# Altium schematic sheet Somador_DC.SchDoc
size A4
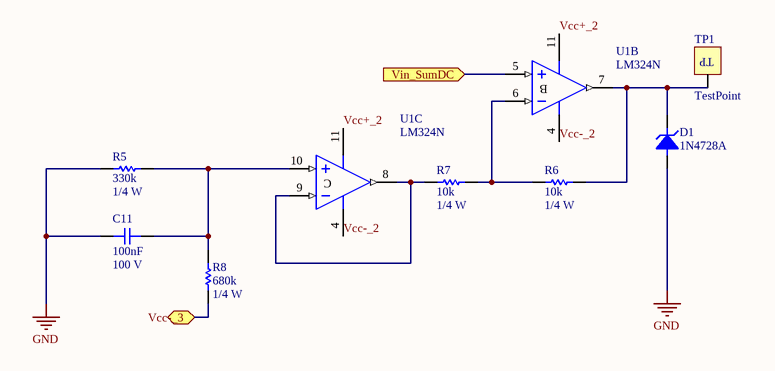
[diagram p0: Somador_DC.SchDoc]

## Parts
C11  100nF  Voltage: 100 V  [0805C]
D1  1N4728A  [DO-41-Glass]
R5  330k  Power: 1/4 W  [0805R]
R6  10k  Power: 1/4 W  [0805R]
R7  10k  Power: 1/4 W  [0805R]
R8  680k  Power: 1/4 W  [0805R]
TP1  TestPoint  [TEST_POINT_PTH]
U1  LM324N  [N014]  (parts B,C of 4)

## Ports
Vcc-_3, Vin_SumDC (in)

## Nets
GND: C11.2 D1.A R5.2
Vcc+_2: U1.11(V-)
Vcc-_2: U1.4(V+)
Vcc-_3: R8.1 ; port Vcc-_3
Vin_SumDC: U1.5(IN+) ; port Vin_SumDC
NetC11_1: C11.1 R5.1 R8.2 U1.10(IN+)
NetD1_K: D1.K R6.2 TP1.1(TP) U1.7(OUT)
NetR6_1: R6.1 R7.2 U1.6(IN-)
NetR7_1: R7.1 U1.8(OUT) U1.9(IN-)

## Notes on the sheet
- (in symbol LM324N, part B) B
- (in symbol LM324N, part C) C

## Library data of the parts
C11 = Capacitor: Published: 8-Jun-2000; LatestRevisionDate: 17-Jul-2002; LatestRevisionNote: Re-released for DXP Platform.; PackageReference: RAD-0.3; Publisher: Altium Limited
D1 = 1N4728A: Zener Diode; Zener Voltage (Vz): 3.3 V; Zener Current (Iz): 276 mA; Power Dissipation (Pd): 1.3 W; Forward Voltage (Vf): 1.2 V
R5-R8 = Resistor: Tolerance: 5%; Published: 8-Jun-2000; LatestRevisionDate: 17-Jul-2002; LatestRevisionNote: Re-released for DXP Platform.; PackageReference: AXIAL-0.3; Publisher: Altium Limited
TP1 = TestPoint: Test Point
U1 = LM324N: Quadruple Operational Amplifier; Published: 16-Jan-2001; LatestRevisionDate: 04-Mar-2005; LatestRevisionNote: Stylized 3D Model Added.; DatasheetVersion: Feb-1997; PackageVersion: Oct-1995; PackageReference: N014; Publisher: Altium Limited; PackageDescription: DIP; 14 Leads; Row Spacing 7.62 mm; Pitch 2.54 mm; ComponentLink1Description: Manufacturer Link; ComponentLink1URL: http://www.ti.com/; ComponentLink2Description: Datasheet; ComponentLink2URL: http://www-s.ti.com/sc/ds/lm324.pdf